# EAGLE design Me-Servo Driver v2.1 (EAGLE 6.2)
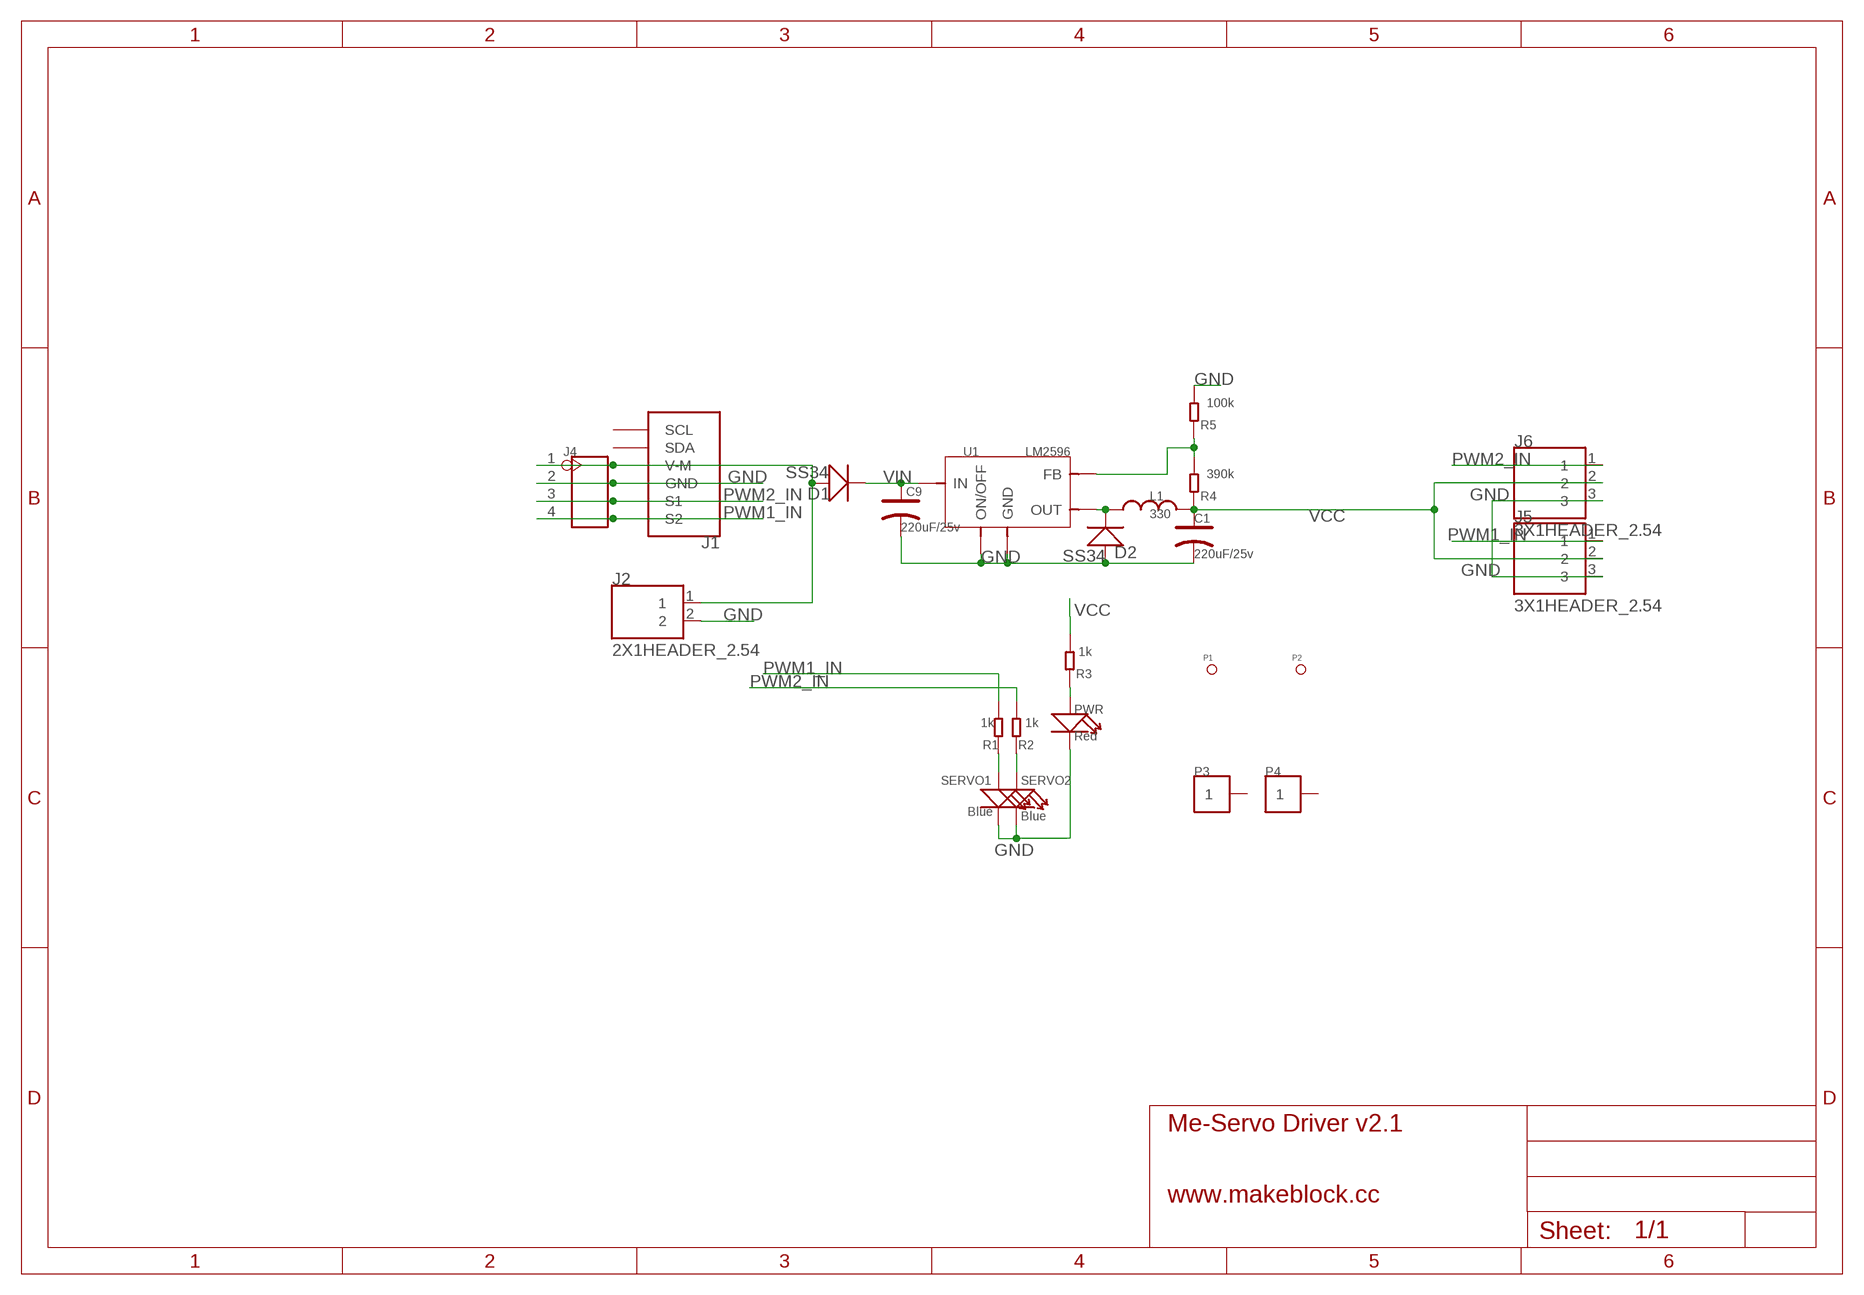
[diagram p0: schematic, sheet 1]

## Parts
C1  220uF/25v  CAP-ELECTRO-E  [ELECTRO-SMD-E-7.8MM]
C9  220uF/25v  CAP-ELECTRO-E  [ELECTRO-SMD-E-7.8MM]
D1  SS34  D'SMA'  [D2010]
D2  SS34  D'SMA'  [D2010]
J1  RJ11-6P6C-MOTOR  [RJ11-6P6C]
J2  2X1HEADER_2.54  [2X1HEADER_2.54]
J4  HEADER-4P-60/35MIL  [4P-65/35MIL]
J5  3X1HEADER_2.54  [3X1HEADER_2.54]
J6  3X1HEADER_2.54  [3X1HEADER_2.54]
L1  330  12X12_INDUCTANCE  [12X12_INDUCTANCE]
P1  PAD-MARK  [ROUND-MARK-1.0]
P2  PAD-MARK  [ROUND-MARK-1.0]
P3  PAD-1P-4MM  [HOLE-01]
P4  PAD-1P-4MM  [HOLE-01]
PWR  Red  LED'0603'  [LED-0603]
R1  1k  R-0603  [0603]
R2  1k  R-0603  [0603]
R3  1k  R-0603  [0603]
R4  390k  R-0603  [0603]
R5  100k  R-0603  [0603]
SERVO1  Blue  LED'0603'  [LED-0603]
SERVO2  Blue  LED'0603'  [LED-0603]
U1  LM2596  [LM2596]

## Nets
GND: C1.- C9.- D2.+ J1.4(GND) J2.2 J4.2 J5.3 J6.3 PWR.- R5.2 SERVO1.- SERVO2.- U1.3(GND) U1.4(GND) U1.6(ON/OFF)
N$1: D1.+ J1.3(V-M) J2.1 J4.1
N$2: PWR.+ R3.1
N$3: R1.1 SERVO1.+
N$4: R2.1 SERVO2.+
N$5: D2.- L1.P$1 U1.2(OUT)
N$6: R4.2 R5.1 U1.5(FB)
PWM1_IN: J1.6(S2) J4.4 J5.1 R1.2
PWM2_IN: J1.5(S1) J4.3 J6.1 R2.2
VCC: C1.+ J5.2 J6.2 L1.P$2 R3.2 R4.1
VIN: C9.+ D1.- U1.1(IN)
Unconnected: J1.1(SCL) J1.2(SDA) P3.1 P4.1

## Notes on the sheet
- www.makeblock.cc

## Library data of the parts
C1 C9 = Discrete:CAP*: Electrolytic Capacitors,Tantalum Capacitors and Super Capacitors
D1 D2 = Discrete:D*
J1 = Makeblock:RJ11-6P6C-MOTOR
J2 = Makeblock:2X1HEADER_2.54
J4 = Connector:HEADER-4P
J5 J6 = Makeblock:3X1HEADER_2.54
L1 = Makeblock:12X12_INDUCTANCE
P1 P2 = Discrete:PAD-MARK; PARTNO: DNP
P3 P4 = Makeblock:PAD-1P*
PWR SERVO1 SERVO2 = Discrete:LED*
R1-R5 = Discrete:R*
U1 = Makeblock:LM2596

## Board
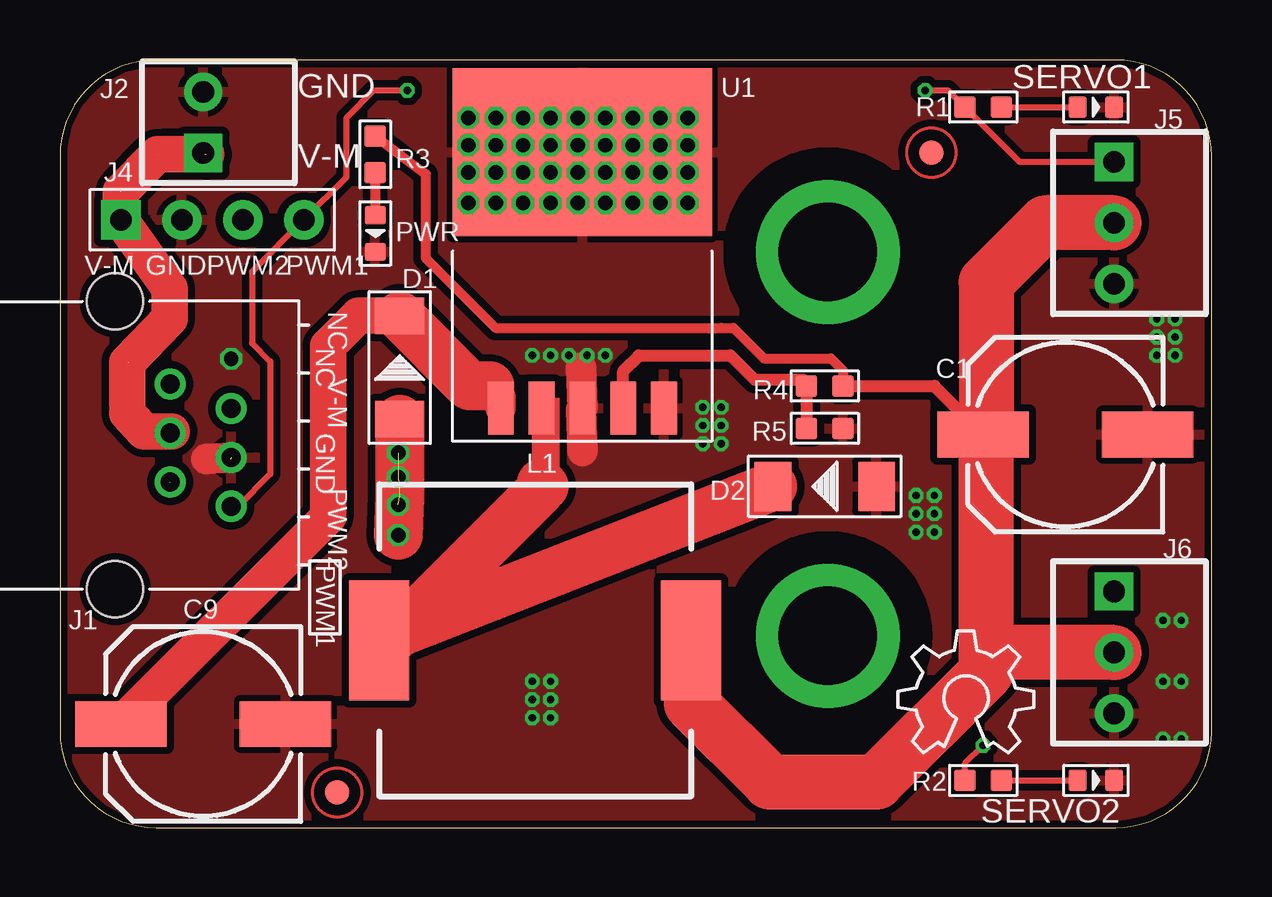
[diagram p1: board, top side]
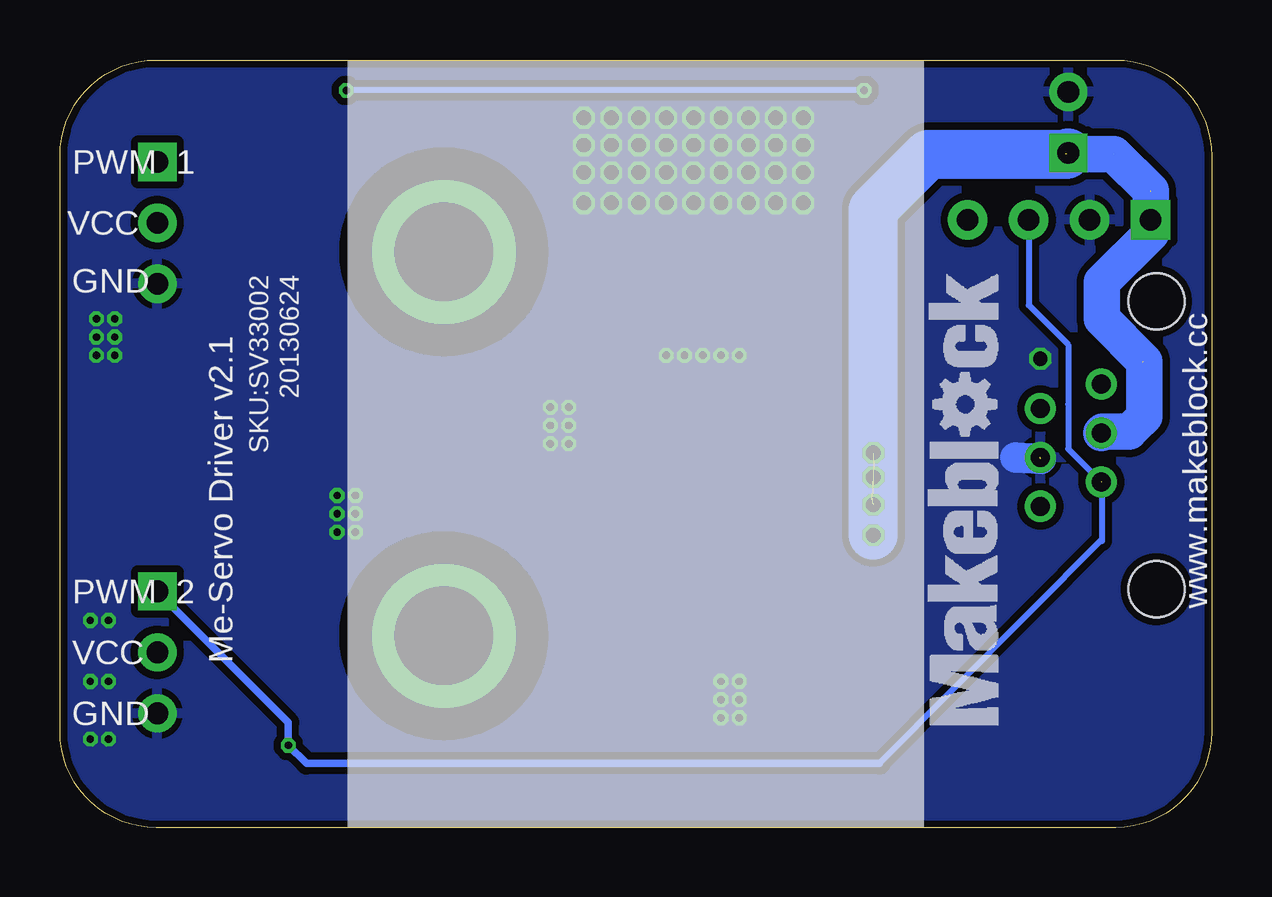
[diagram p2: board, bottom side, seen from below]

Size 48 x 32 mm. Coordinates in mm from the lower left corner, seen from the top.
Outline: 0,28 0,4 arc90 4,0 44,0 arc90 48,4 48,28 arc90 44,32 4,32 arc90 0,28
Copper layers (1*16): Top 0.035mm / dielectric 1.5mm / Bottom 0.035mm
Design rules: minimum track width 6mil, minimum drill 12mil, track to track 8mil, track to pad 8mil, pad to pad 8mil, via to via 8mil, smd to smd 0mil, copper to edge 10mil, drill to drill 10mil, minimum pad ring 10mil, minimum via ring 6mil, stop-mask expansion 2mil, vias tented up to drill 100mil, thermal gap 10mil

### Footprints (pad centres in the part's own frame; a part is rotated, then mirrored left to right if it is on the bottom)
ELECTRO-SMD-E-7.8MM = smd 3.81 x 1.905: + 3.429,0; - -3.429,0
D2010 = smd 1.524 x 2.032: + -2.159,0; - 2.159,0
RJ11-6P6C = drill 0.8: 1 -2.55,1.8; 2 -1.53,4.34; 3 -0.51,1.8; 4 0.51,4.34; 5 1.53,1.8; 6 2.55,4.34 | hole 2.35: -6,-0.5; 6,-0.5
2X1HEADER_2.54 = drill 0.9 pad 1.6 square: 1 0,-2.54 | drill 0.9 pad 1.6: 2 0,0
4P-65/35MIL = drill 0.889 pad 1.651 square: 1 0,3.81 | drill 0.889 pad 1.651: 2 0,1.27; 3 0,-1.27; 4 0,-3.81
3X1HEADER_2.54 = drill 0.9 pad 1.6 square: 1 0,2.54 | drill 0.9 pad 1.6: 2 0,0; 3 0,-2.54
12X12_INDUCTANCE = smd 2.5 x 5: P$1 -6.5,0; P$2 6.5,0
ROUND-MARK-1.0 = smd 1.016 x 1.016: P$1 0,0
HOLE-01 = drill 4.1 pad 6: 1 0,0
LED-0603 = smd 0.762 x 0.889: + -0.762,0; - 0.762,0
0603 = smd 0.889 x 0.889: 1 -0.762,0; 2 0.762,0
LM2596 = smd 2.2 x 1.07: 1 14.17,-3.4; 2 14.17,-1.7; 4 14.17,0; 5 14.17,1.7; 6 14.17,3.4 | smd 7 x 10.8: 3 3.5,0

### Placement (x,y rotation side)
C1  41.91,16.38 180 top
C9  5.97,4.32 180 top
D1  14.16,19.18 90 top
D2  31.88,14.22 180 top
J1  2.79,15.94 270 top
J2  5.97,30.67 0 top
J4  6.35,25.34 90 top
J5  43.94,25.21 0 top
J6  43.94,7.3 0 top
L1  19.81,7.81 0 top
P1  11.56,1.46 0 top
P2  36.32,28.13 0 top
P3  32,8 0 top
P4  32,24 0 top
PWR  13.14,24.77 270 top
R1  38.48,30.04 180 top
R2  38.48,1.97 180 top
R3  13.14,28.07 90 top
R4  31.88,18.41 180 top
R5  31.88,16.64 0 top
SERVO1  43.18,30.04 0 top
SERVO2  43.18,1.97 0 top
U1  21.77,31.66 270 top
U$1  [OSHW_6X200_NOTEXT]  34.92,3.11 0 top
U$3  [LOGO-3/2]  8.88,4.25 90 bottom

### Tracks (layer width: path | path; a pad name or v marks a point on that pad's centre or on a via)
GND  (via drill 0.3 pad 0.61, 0.6, 0.6 pad 0.61)  (2 unrouted)
  Top 1.27: U1.4 21.72,19.18 | 21.77,15.71 21.72,17.4 | 7.15,15.42 6.1,15.37
  Bottom 1.27: 8.17,15.42 7.11,15.37
  other vias: 7.14,19.54 17.02,29.59 18.16,29.59 19.3,29.59 20.45,29.59 21.59,29.59 22.73,29.59 23.88,29.59 25.02,29.59 26.16,29.59 17.02,28.45 18.16,28.45 19.3,28.45 20.45,28.45 21.59,28.45 22.73,28.45 23.88,28.45 25.02,28.45 26.16,28.45 17.02,27.3 18.16,27.3 19.3,27.3 20.45,27.3 21.59,27.3 22.73,27.3 23.88,27.3 25.02,27.3 26.16,27.3 17.02,26.04 18.16,26.04 19.3,26.04 20.45,26.04 21.59,26.04 22.73,26.04 23.88,26.04 25.02,26.04 26.16,26.04 19.68,19.68 20.45,19.68 21.21,19.68 21.97,19.68 22.73,19.68 27.56,17.53 27.56,16.76 27.56,16 26.8,16 26.8,16.76 26.8,17.53 46.48,21.21 46.48,20.45 46.48,19.68 45.72,19.68 45.72,20.45 45.72,21.21 46.74,8.64 46.74,6.1 46.74,3.68 45.97,3.68 45.97,6.1 45.97,8.64 36.45,13.84 36.45,13.08 36.45,12.32 35.69,12.32 35.69,13.08 35.69,13.84 20.45,6.1 20.45,5.33 20.45,4.57 19.68,4.57 19.68,5.33 19.68,6.1
  pour Bottom (isolate 0.305): 0,32.07 48.01,32.07 48.01,-0.19 0,-0.19
  pour Top (isolate 0.305): 0,32.07 48.01,32.07 48.01,-0.19 0,-0.19
N$1  (via drill 0.6)  (7 unrouted)
  Top 0.406: 2.79,19.3 2.79,19.39 2.86,19.39 2.86,19.49 | 3.56,16.51 3.68,16.51 | 3.56,16.51 4.59,16.51 J1.3 | 3.56,16.51 3.52,16.51
  Top 1.524: 3.56,16.51 3.68,16.51 4.66,16.51 | 2.79,17.27 3.52,16.51 | 2.79,17.65 2.79,19.3 2.79,19.39 | 2.83,19.43 4.57,21.21 4.57,22.48 J4.1 | 2.54,25.4 2.54,26.5 | 4.06,28.07 2.58,26.54 | 6.1,28.07 4.23,28.07
  Top 2.032: D1.+ 14.16,13.78 v14.1,12.19
  Bottom 1.524: J1.3 4.53,16.51 3.43,16.51 2.92,17.02 2.79,17.14 2.79,19.43 4.57,21.21 4.57,22.73 2.54,24.77 J4.1 2.54,26.54 4.06,28.07 5.91,28.07 J2.1
  Bottom 2.032: v14.1,12.19 14.1,25.78 11.81,28.07 6.03,28.07 J2.1
  other vias: 14.1,14.61 14.1,15.62 14.1,13.46
N$2
  Top 0.406: R3.1 PWR.+
N$3
  Top 0.254: R1.1 SERVO1.+
N$4
  Top 0.254: R2.1 SERVO2.+
N$5
  Top 0.508: 20.07,14.1 20.07,14.35 20.07,17.48 U1.2
  Top 2.032: 20.07,14.1 13.78,7.81 L1.P$1 D2.- | 20.19,14.22 20.07,14.35
N$6
  Top 0.508: U1.5 23.47,19.03 24.13,19.68 27.94,19.68 28.96,18.67 30.99,18.67 R4.2 R5.1
PWM1_IN  (via drill 0.3 pad 0.61)
  Top 0.254: J1.6 7.42,13.39 8.76,14.73 8.76,16.76 8.76,19.43 8,20.19 8,23.18 J4.4 11.94,27.11 11.94,29.59 13.08,30.73 v14.48,30.73 | J5.1 40.01,27.75 R1.2 37.02,30.73 v36.07,30.73
  Bottom 0.254: v14.48,30.73 v36.07,30.73
PWM2_IN  (via drill 0.3 pad 0.61)  (1 unrouted)
  Top 0.254: R2.2 37.72,2.67 v38.48,3.43
  Bottom 0.254: J4.3 7.62,21.78 5.97,20.13 5.97,17.65 5.97,15.78 J1.5 | 4.57,14.41 4.57,12 | 4.57,12 4.57,11.94 | 4.57,12 13.84,2.67
  Bottom 0.305: J6.1 38.48,4.38 v38.48,3.43 37.72,2.67 13.84,2.67
VCC
  Top 0.406: R3.2 15.24,27.24 15.24,23.75 18.16,20.83 27.56,20.83 28.07,20.83 29.34,19.56 32.13,19.56 32.64,19.05 R4.1
  Top 0.508: R4.1 36.45,18.41 C1.+
  Top 2.286: L1.P$2 26.31,5.18 29.59,1.91 34.04,1.91 38.61,6.48 38.61,7.37 | 38.61,7.37 38.61,16.26 C1.+ 38.61,16.51 38.61,22.73 41.08,25.21 J5.2 | J6.2 38.67,7.3 38.61,7.37
VIN
  Top 1.27: U1.1 18.37,17.95 17.91,18.41
  Top 1.524: 14.52,21.34 D1.- 12.45,21.34 11.18,20.07 11.18,12.95 C9.+
  Top 2.032: 17.91,18.41 17.08,18.41 D1.-
(copper drawn outside any net)
  shapes: Top area x1

### Text on the board
tPlace: GND | V-M | V-M | GND | PWM2 | PWM1 | NC | NC | V-M | GND | PWM2 | PWM1
bPlace: PWM 1 | VCC | 20130624 | SKU:SV33002 | GND | www.makeblock.cc | PWM 2 | Me-Servo Driver v2.1 | VCC | GND
_tNames: PWR | PWR | U1 | U1 | SERVO-1 | SERVO-1 | J4 | J4 | R1 | R1 | R3 | R3 | J5 | J5 | R4 | R4 | R5 | R5 | C4 | C4 | J6 | J6 | C2 | C2 | J1 | J1 | C3 | C3 | R2 | R2 | SERVO-2 | SERVO-2 | D1 | D1 | C5 | C5
_tFinish: R1 | R1 | R3 | R3 | R4 | R4 | R5 | R5 | C3 | C3 | C2 | C2 | R2 | R2